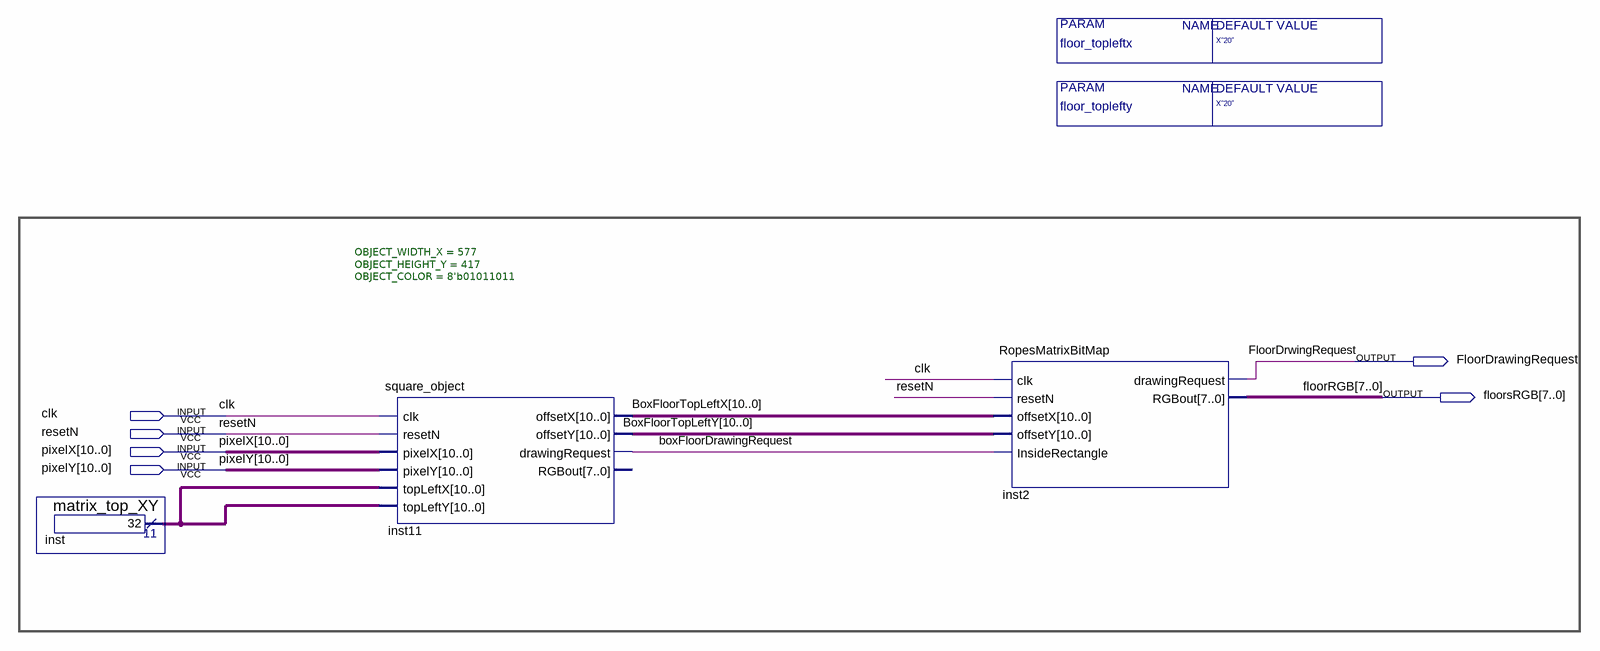
[diagram p0: schematic sheet]
// Quartus schematic ROPES_DISPLAY.bdf as structural Verilog: 3 symbols, 6 pins
module ROPES_DISPLAY #(parameter floor_toplefty = "X\"20\"", parameter floor_topleftx = "X\"20\"") (
  input  clk,
  input  resetN,
  input  [10:0] pixelX,
  input  [10:0] pixelY,
  output FloorDrawingRequest,
  output [7:0] floorsRGB
);

  wire boxFloorDrawingRequest;
  wire [10:0] BoxFloorTopLeftX, BoxFloorTopLeftY, inst_result;

  matrix_top_XY inst (.result(inst_result));
  square_object #(.OBJECT_WIDTH_X(577), .OBJECT_HEIGHT_Y(417), .OBJECT_COLOR(8'b01011011)) inst11 (
    .clk(clk), .resetN(resetN), .pixelX(pixelX), .pixelY(pixelY), .topLeftX(inst_result),
    .topLeftY(inst_result), .offsetX(BoxFloorTopLeftX), .offsetY(BoxFloorTopLeftY),
    .drawingRequest(boxFloorDrawingRequest));  // open: RGBout
  RopesMatrixBitMap inst2 (
    .clk(clk), .resetN(resetN), .offsetX(BoxFloorTopLeftX), .offsetY(BoxFloorTopLeftY),
    .InsideRectangle(boxFloorDrawingRequest), .drawingRequest(FloorDrawingRequest), .RGBout(floorsRGB));

  // Other names for the same wires on the sheet: FloorDrwingRequest = FloorDrawingRequest; floorRGB[7:0] = floorsRGB
endmodule
